# Altium schematic sheet test.SchDoc
size A4
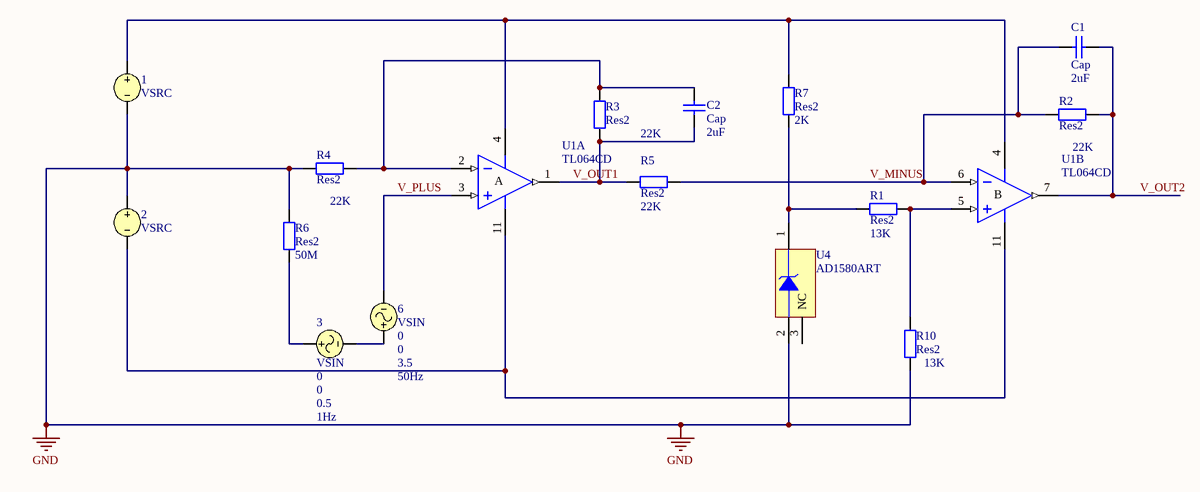
[diagram p0: test.SchDoc]

## Parts
1  VSRC
2  VSRC
3  VSIN  value 0  Amplitude: 0.5  Frequency: 1Hz
6  VSIN  value 0  Amplitude: 3.5  Frequency: 50Hz
C1  Cap  value 2uF  [RAD-0.3]
C2  Cap  value 2uF  [RAD-0.3]
R1  Res2  value 13K  [AXIAL-0.4]
R2  Res2  value 22K  [AXIAL-0.4]
R3  Res2  value 22K  [AXIAL-0.4]
R4  Res2  value 22K  [AXIAL-0.4]
R5  Res2  value 22K  [AXIAL-0.4]
R6  Res2  value 50M  [AXIAL-0.4]
R7  Res2  value 2K  [AXIAL-0.4]
R10  Res2  value 13K  [AXIAL-0.4]
U1  TL064CD  [SO14_N]  (parts A,B of 4)
U4  AD1580ART  [RT-3_N]

## Nets
GND: 1.2 2.1 R4.1 R6.2 R10.1 U4.2(V-)
V_MINUS: C1.2 R2.2 R5.1 U1.6(IN-)
V_OUT1: C2.2 R3.1 R5.2 U1.1(OUT)
V_OUT2: C1.1 R2.1 U1.7(OUT)
V_PLUS: 6.2 U1.3(IN+)
Net1_1: 1.1 R7.2 U1.4(V+)
Net2_2: 2.2 U1.11(V-)
Net3_1: 3.1 R6.1
Net3_2: 3.2 6.1
NetC2_1: C2.1 R3.2 R4.2 U1.2(IN-)
NetR1_1: R1.1 R10.2 U1.5(IN+)
NetR1_2: R1.2 R7.1 U4.1(V+)

Not connected (* = marked no-connect by the designer): U4 3(NC)

## Notes on the sheet
- (in symbol TL064CD, part A) A
- (in symbol TL064CD, part B) B

## Library data of the parts
1 2 = VSRC: Voltage Source; Note: PCB Footprint - Not required; Value: +5; Published: 8-Jun-2000; LatestRevisionDate: 17-Jul-2002; LatestRevisionNote: Re-released for DXP Platform.; PackageReference: Not Applicable; Publisher: Altium Limited
3 6 = VSIN: Sinusoidal Voltage Source; Note: PCB Footprint - Not required; Published: 8-Jun-2000; LatestRevisionDate: 15-Nov-2004; LatestRevisionNote: Corrected Netlist.; PackageReference: Not Applicable; Publisher: Altium Limited; Offset: 0
C1 C2 = Cap: Capacitor; Published: 8-Jun-2000; LatestRevisionDate: 17-Jul-2002; LatestRevisionNote: Re-released for DXP Platform.; PackageReference: RAD-0.3; Publisher: Altium Limited; PackageDescription: Radial Cap, Thru-Hole; 2 Leads; 0.3 in Pin Spacing
R1-R7 R10 = Res2: Resistor; Published: 8-Jun-2000; LatestRevisionDate: 17-Jul-2002; LatestRevisionNote: Re-released for DXP Platform.; PackageReference: AXIAL-0.4; Publisher: Altium Limited; PackageDescription: Axial Device, Thru-Hole; 2 Leads; 0.4 in Pin Spacing
U1 = TL064CD: Low-Power J-FET Quad Operational Amplifier; Published: 24-Aug-2001; LatestRevisionDate: 13-Apr-2006; LatestRevisionNote: IPC-7351 Footprint Added.; DatasheetVersion: Oct-1997; PackageVersion: Sep-1998; PackageReference: SO14; Publisher: Altium Limited; PackageDescription: 14-Pin Small Outline Integrated Circuit 1.27 mm Pitch; Code_IPC: SOIC127P600-14; ComponentLink1Description: Manufacturer Link; ComponentLink1URL: http://www.st.com/; ComponentLink2Description: Datasheet; ComponentLink2URL: http://www.st.com/stonline/products/literature/ds/2295/tl064.pdf
U4 = AD1580ART: 1.2V Micropower, Precision Shunt Voltage Reference; Note: Pin 3 is not connected or GND; Published: 8-Jun-2000; LatestRevisionDate: 29-May-2009; LatestRevisionNote: IPC-7351 Footprint Added.; DatasheetVersion: REV. 0 1995; PackageVersion: rev0; PackageReference: RT-3; Publisher: Altium Limited; PackageDescription: 3-Pin SOT-23 Package 0.95 mm Pitch, 2.4 mm Lead Span; ComponentLink1Description: Manufacturer Link; ComponentLink1URL: http://www.analog.com/en/prod/0%2C2877%2CAD1580%2C00.html; ComponentLink2Description: Datasheet; ComponentLink2URL: http://www.analog.com/UploadedFiles/Data_Sheets/501400529AD1580_b.pdf